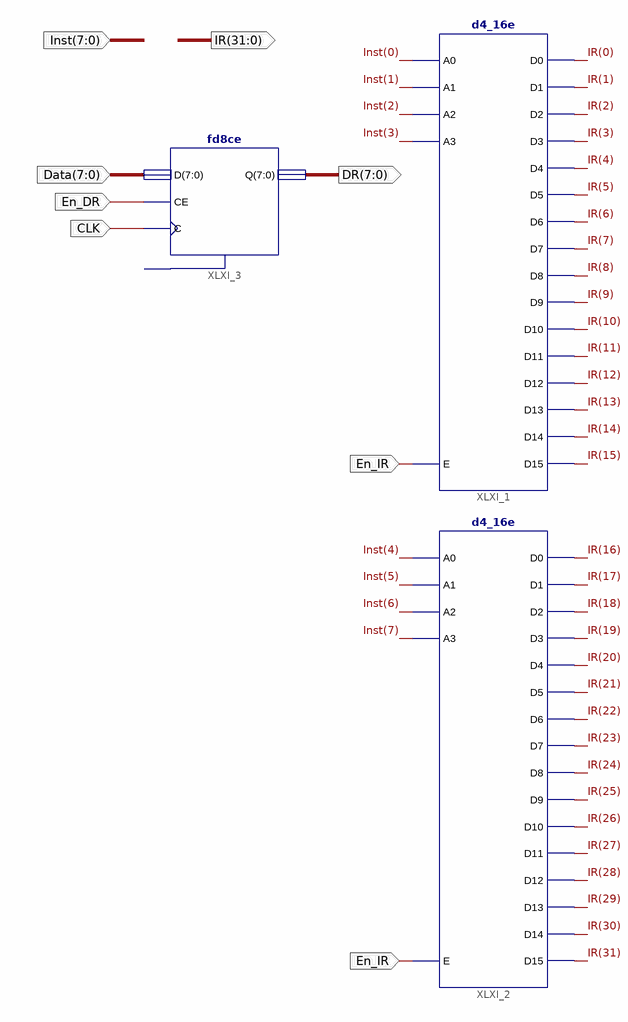
[diagram p0: schematic sheet 1]
// Xilinx ISE schematic ControlUnit.sch (spartan3e) as structural Verilog: 3 symbols, 7 ports
module ControlUnit (
  input  [7:0] Inst,
  input  [7:0] Data,
  input  En_IR,
  input  En_DR,
  input  CLK,
  output [31:0] IR,
  output [7:0] DR
);

  d4_16e XLXI_1 (
    .A0(Inst[0]), .A1(Inst[1]), .A2(Inst[2]), .A3(Inst[3]), .E(En_IR), .D0(IR[0]), .D1(IR[1]), .D10(IR[10]),
    .D11(IR[11]), .D12(IR[12]), .D13(IR[13]), .D14(IR[14]), .D15(IR[15]), .D2(IR[2]), .D3(IR[3]), .D4(IR[4]),
    .D5(IR[5]), .D6(IR[6]), .D7(IR[7]), .D8(IR[8]), .D9(IR[9]));
  d4_16e XLXI_2 (
    .A0(Inst[4]), .A1(Inst[5]), .A2(Inst[6]), .A3(Inst[7]), .E(En_IR), .D0(IR[16]), .D1(IR[17]),
    .D10(IR[26]), .D11(IR[27]), .D12(IR[28]), .D13(IR[29]), .D14(IR[30]), .D15(IR[31]), .D2(IR[18]),
    .D3(IR[19]), .D4(IR[20]), .D5(IR[21]), .D6(IR[22]), .D7(IR[23]), .D8(IR[24]), .D9(IR[25]));
  fd8ce XLXI_3 (.C(CLK), .CE(En_DR), .D(Data), .Q(DR));  // open: CLR
endmodule
